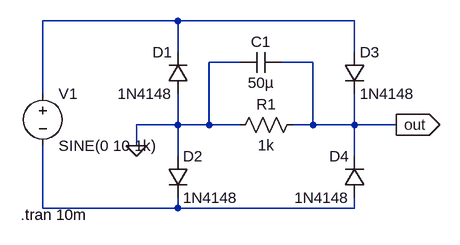
[diagram p0: schematic Full_Rectifier.asc]
Full_Rectifier.asc, the LTspice schematic file:
Version 4
SHEET 1 880 680
WIRE 256 16 48 16
WIRE 528 16 256 16
WIRE 256 64 256 16
WIRE 528 64 528 16
WIRE 352 80 304 80
WIRE 464 80 416 80
WIRE 48 128 48 16
WIRE 256 176 256 128
WIRE 256 176 192 176
WIRE 304 176 304 80
WIRE 304 176 256 176
WIRE 352 176 304 176
WIRE 464 176 464 80
WIRE 464 176 432 176
WIRE 528 176 528 128
WIRE 528 176 464 176
WIRE 592 176 528 176
WIRE 192 208 192 176
WIRE 256 224 256 176
WIRE 528 224 528 176
WIRE 48 304 48 208
WIRE 256 304 256 288
WIRE 256 304 48 304
WIRE 528 304 528 288
WIRE 528 304 256 304
FLAG 192 208 0
FLAG 592 176 out
IOPIN 592 176 Out
SYMBOL voltage 48 112 R0
WINDOW 123 0 0 Left 0
WINDOW 39 0 0 Left 0
SYMATTR InstName V1
SYMATTR Value SINE(0 10 1k)
SYMBOL res 448 160 R90
WINDOW 0 0 56 VBottom 2
WINDOW 3 32 56 VTop 2
SYMATTR InstName R1
SYMATTR Value 1k
SYMBOL cap 416 64 R90
WINDOW 0 0 32 VBottom 2
WINDOW 3 32 32 VTop 2
SYMATTR InstName C1
SYMATTR Value 50µ
SYMBOL diode 272 128 R180
WINDOW 0 24 64 Left 2
WINDOW 3 24 0 Left 2
SYMATTR InstName D1
SYMATTR Value 1N4148
SYMBOL diode 240 224 R0
SYMATTR InstName D2
SYMATTR Value 1N4148
SYMBOL diode 512 64 R0
SYMATTR InstName D3
SYMATTR Value 1N4148
SYMBOL diode 544 288 R180
WINDOW 0 24 64 Left 2
WINDOW 3 24 0 Left 2
SYMATTR InstName D4
SYMATTR Value 1N4148
TEXT 14 314 Left 2 !.tran 10m

The netlist it stands for:
* Full_Rectifier.asc
V1 N001 N002 SINE(0 10 1k)
R1 out 0 1k
C1 out 0 50µ
D1 0 N001 1N4148
D2 0 N002 1N4148
D3 N001 out 1N4148
D4 N002 out 1N4148
.model D D
.lib standard.dio
.tran 10m
.backanno
.end